# EAGLE schematic FLR - Schematic (EAGLE 9.6.2)
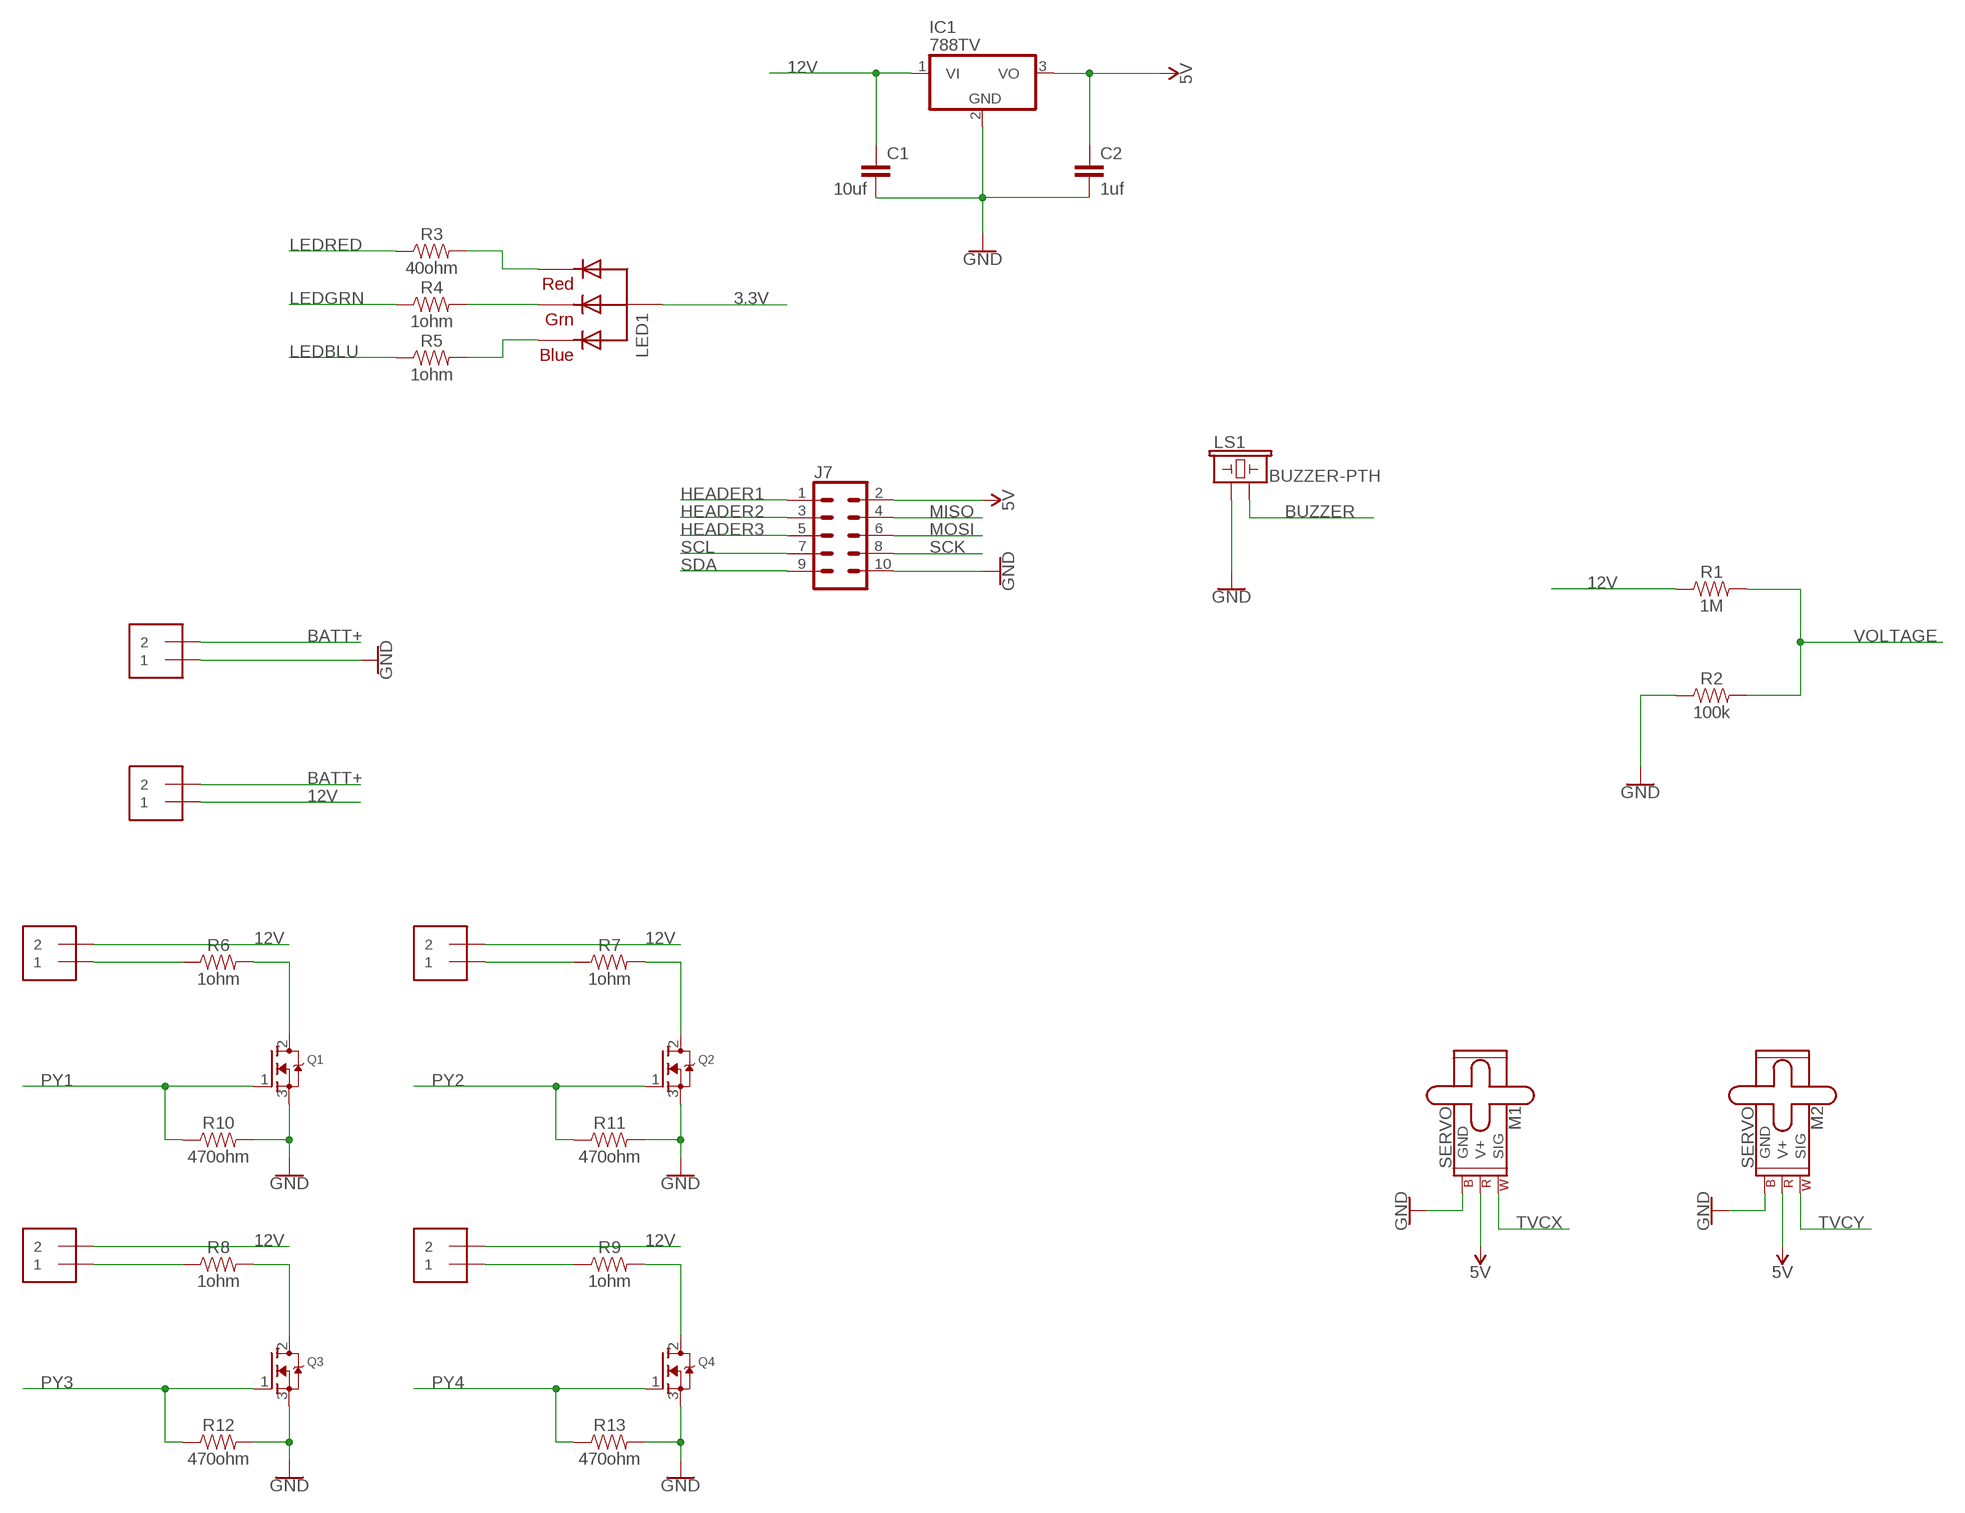
[diagram p0: schematic, sheet 1, part 1 of 2]
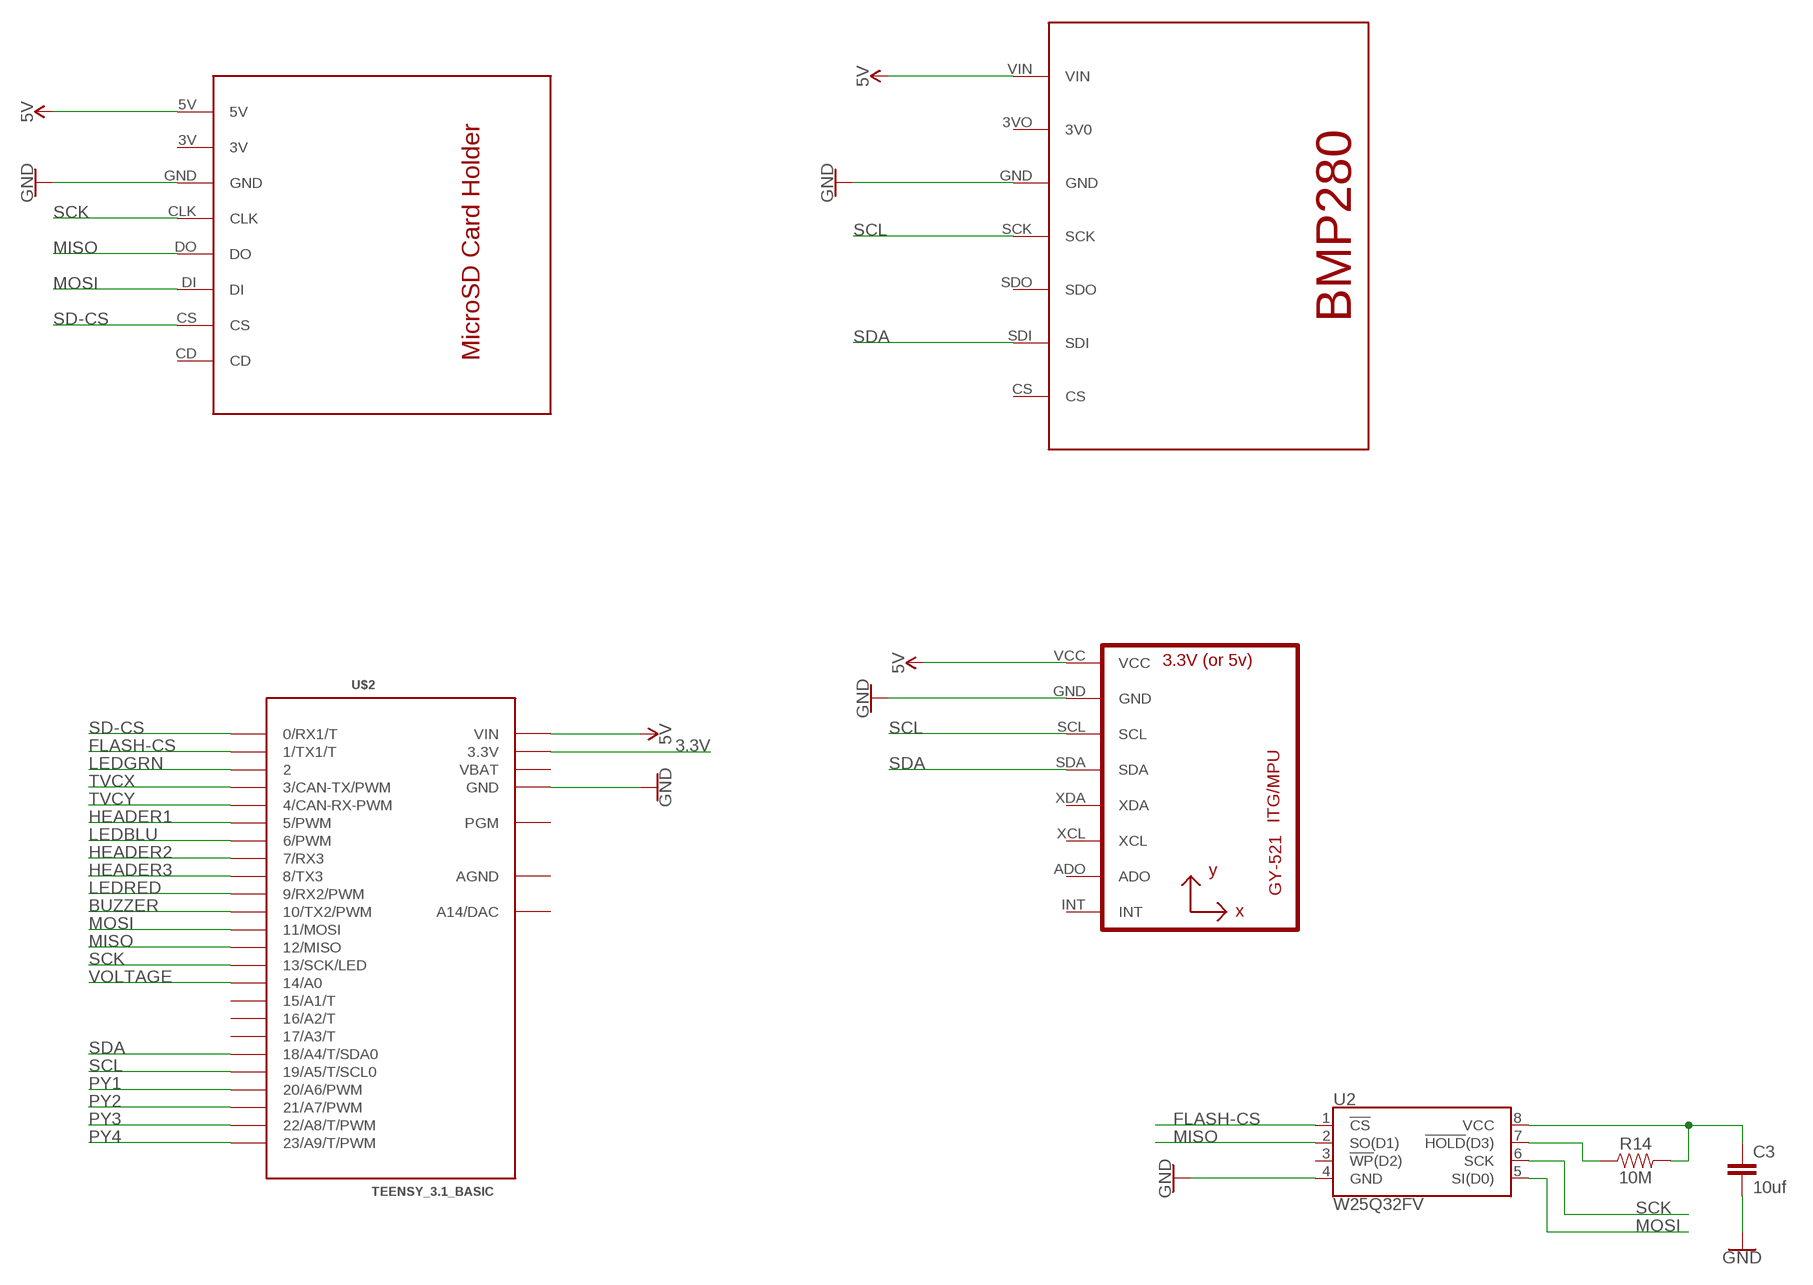
[diagram p1: schematic, sheet 1, part 2 of 2]

## Parts
C1  10uf  22PF-PTH-2.54MM-200V-5%  [CAP-PTH-2.54]
C2  1uf  22PF-PTH-2.54MM-200V-5%  [CAP-PTH-2.54]
C3  10uf  22PF-PTH-2.54MM-200V-5%  [CAP-PTH-2.54]
IC1  788TV  [TO220V]
J1  1X2-3.5MM  [1X2-3.5MM]
J2  1X2-3.5MM  [1X2-3.5MM]
J3  1X2-3.5MM  [1X2-3.5MM]
J4  1X2-3.5MM  [1X2-3.5MM]
J5  1X2-3.5MM  [1X2-3.5MM]
J6  1X2-3.5MM  [1X2-3.5MM]
J7  CONN_05X2NO_SILK  [2X5_NOSILK]
LED1  RGBLED_CA-5MM  [LED5MMRGB]
LS1  BUZZER-PTH  [BUZZER-12MM]
M1  SERVO  [1X03]
M2  SERVO  [1X03]
Q1  MOSFET-NGDS_TO220V  [TO220V]
Q2  MOSFET-NGDS_TO220V  [TO220V]
Q3  MOSFET-NGDS_TO220V  [TO220V]
Q4  MOSFET-NGDS_TO220V  [TO220V]
R1  1M  10MOHM-HORIZ-1/4W-5%  [AXIAL-0.3]
R2  100k  10MOHM-HORIZ-1/4W-5%  [AXIAL-0.3]
R3  40ohm  10MOHM-HORIZ-1/4W-5%  [AXIAL-0.3]
R4  1ohm  10MOHM-HORIZ-1/4W-5%  [AXIAL-0.3]
R5  1ohm  10MOHM-HORIZ-1/4W-5%  [AXIAL-0.3]
R6  1ohm  10MOHM-HORIZ-1/4W-5%  [AXIAL-0.3]
R7  1ohm  10MOHM-HORIZ-1/4W-5%  [AXIAL-0.3]
R8  1ohm  10MOHM-HORIZ-1/4W-5%  [AXIAL-0.3]
R9  1ohm  10MOHM-HORIZ-1/4W-5%  [AXIAL-0.3]
R10  470ohm  10MOHM-HORIZ-1/4W-5%  [AXIAL-0.3]
R11  470ohm  10MOHM-HORIZ-1/4W-5%  [AXIAL-0.3]
R12  470ohm  10MOHM-HORIZ-1/4W-5%  [AXIAL-0.3]
R13  470ohm  10MOHM-HORIZ-1/4W-5%  [AXIAL-0.3]
R14  10M  10MOHM-HORIZ-1/4W-5%  [AXIAL-0.3]
U1  GY-521MPU6050  [GY-521]
U2  W25Q32FV  W25Q32FVSS  [SOIC-8]
U$1  MICROSDCARD  [MICROSDCARD]
U$2  TEENSY_3.1_BASIC  [TEENSY_3.1_BASIC]
U$3  BMP280  [BMP280]

## Nets
3.3V: LED1.2(VCC) U$2.3.3V U$2.3.3V1(3.3V)
5V: C2.1 IC1.3(VO) J7.2 M1.2(V+) M2.2(V+) U1.VCC U$1.5V U$2.VIN U$3.VIN
12V: C1.1 IC1.1(VI) J2.1 J3.2 J4.2 J5.2 J6.2 R1.P$1
BATT+: J1.2 J2.2
BUZZER: LS1.- U$2.10(10/TX2/PWM)
FLASH-CS: U2.1(!CS!) U$2.1(1/TX1/T)
GND: C1.2 C2.2 C3.2 IC1.2(GND) J1.1 J7.10 LS1.+ M1.3(GND) M2.3(GND) Q1.3(S) Q2.3(S) Q3.3(S) Q4.3(S) R2.P$1 R10.P$2 R11.P$2 R12.P$2 R13.P$2 U1.GND U2.4(GND) U$1.GND U$2.GND U$2.GND1(GND) U$3.GND
HEADER1: J7.1 U$2.5(5/PWM)
HEADER2: J7.3 U$2.7(7/RX3)
HEADER3: J7.5 U$2.8(8/TX3)
LEDBLU: R5.P$1 U$2.6(6/PWM)
LEDGRN: R4.P$1 U$2.2
LEDRED: R3.P$1 U$2.9(9/RX2/PWM)
MISO: J7.4 U2.2(SO(D1)) U$1.DO U$2.12(12/MISO)
MOSI: J7.6 U2.5(SI(D0)) U$1.DI U$2.11(11/MOSI)
N$1: Q1.2(D) R6.P$2
N$2: LED1.1(RED) R3.P$2
N$3: LED1.3(GREEN) R4.P$2
N$4: LED1.4(BLUE) R5.P$2
N$5: J3.1 R6.P$1
N$6: Q2.2(D) R7.P$2
N$7: J4.1 R7.P$1
N$8: Q3.2(D) R8.P$2
N$9: J5.1 R8.P$1
N$10: Q4.2(D) R9.P$2
N$11: J6.1 R9.P$1
N$12: C3.1 R14.P$2 U2.8(VCC)
N$13: R14.P$1 U2.7(!HOLD!(D3))
PY1: Q1.1(G) R10.P$1 U$2.20/A6(20/A6/PWM)
PY2: Q2.1(G) R11.P$1 U$2.21/A7(21/A7/PWM)
PY3: Q3.1(G) R12.P$1 U$2.22/A8(22/A8/T/PWM)
PY4: Q4.1(G) R13.P$1 U$2.23/A9(23/A9/T/PWM)
SCK: J7.8 U2.6(SCK) U$1.CLK U$2.13(13/SCK/LED)
SCL: J7.7 U1.SCL U$2.19/A5(19/A5/T/SCL0) U$3.SCK
SD-CS: U$1.CS U$2.0(0/RX1/T)
SDA: J7.9 U1.SDA U$2.18/A4(18/A4/T/SDA0) U$3.SDI
TVCX: M1.1(SIG) U$2.3(3/CAN-TX/PWM)
TVCY: M2.1(SIG) U$2.4(4/CAN-RX-PWM)
VOLTAGE: R1.P$2 R2.P$2 U$2.14/A0
Unconnected: U1.ADO U1.INT U1.XCL U1.XDA U2.3(!WP!(D2)) U$1.3V U$1.CD U$2.15/A1(15/A1/T) U$2.16/A2(16/A2/T) U$2.17/A3(17/A3/T) U$2.A14(A14/DAC) U$2.PGM U$3.3VO(3V0) U$3.CS U$3.SDO

## Power pins joined to a net without a drawn wire
AGND: U$2.AGND
VBAT: U$2.VBAT

## Library data of the parts
C1-C3 = SparkFun-Capacitors:22PF: 22pF ceramic capacitors A capacitor is a passive two-terminal electrical component used to store electrical energy temporarily in an electric field.; PROD_ID: CAP-09128; VALUE: 22pF
IC1 = linear:78*: Positive VOLTAGE REGULATOR Source: http://cache.national.com/ds/LM/LM78L05.pdf http://www.fairchildsemi.com/ds/LM/LM7805.pdf
J1-J6 = adafruit:1X2: 3.5mm Terminal block http://www.ladyada.net/library/pcb/eaglelibrary.html
J7 = SparkFun-Connectors:CONN_05X2: Multi connection point. Often used as Generic Header-pin footprint for 0.1 inch spaced/style header connections For AVR SPI programming port, see special device with nice symbol: "AVR_SPI_PROG_5x2.dev" You can populate with any combo of single row headers, but if you'd like an exact match, check these: 2x5 AVR ICSP Male Header <https://www.sparkfun.com/products/778> (PRT-00778) 2x5 Pin Shrouded Header <https://www.sparkfun.com/products/8506> (PRT-08506) On any of the 0.1 inch spaced packages, you can populate with these: Break Away Headers - Straight <https://www.sparkfun.com/products/116> (PRT-00116) Break Away Male Headers - Right Angle <https://www.sparkfun.com/products/553> (PRT-00553) Female Headers <https://www.sparkfun.com/products/115> (PRT-00115) Break Away Headers - Machine Pin <https://www.sparkfun.com/products/117> (PRT-00117) Break Away Female Headers - Swiss Machine Pin <https://www.sparkfun.com/products/743> (PRT-00743) Special note: the shrouded connector mates well with our 5x2 ribbon cables: 2x5 Pin IDC Ribbon Cable <https://www.sparkfun.com/products/8535> (PRT-08535)
LED1 = adafruit:RGBLED_CA: RGB LED, common-anode 5MM Staggered pins 5mm Piranha package http://www.ladyada.net/library/pcb/eaglelibrary.html
LS1 = SparkFun-Electromechanical:BUZZER: Buzzer Small round buzzers that operate around the audible 2kHz range. You can use these as speakers to create simple music or user interfaces. Variant Overview: PTH - Mini Speaker - PC Mount 12mm 2.048kHz <https://www.sparkfun.com/products/7950> PTH_KIT - Mini Speaker - PC Mount 12mm 2.048kHz <https://www.sparkfun.com/products/7950> KIT simplifies soldering by adding stop mask to one side of the pads. PTH_NO_SILK - Mini Speaker - PC Mount 12mm 2.048kHz <https://www.sparkfun.com/products/7950> No silkscreen indicator of buzzer outline. PTH_KIT_NO_SILK - Mini Speaker - PC Mount 12mm 2.048kHz <https://www.sparkfun.com/products/7950> KIT package w/o silkscreen SMD - Buzzer Audio Magnetic (CCV-084B16) SMD buzzer used on, e.g. the LilyPad Buzzer <https://www.sparkfun.com/products/8463> and RFID USB Reader <https://www.sparkfun.com/products/9963>. SMD_KIT - Buzzer Audio Magnetic (CCV-084B16) SMD Buzzer with elongated pins to make soldering easier. Used on the SparkFun Simon Says - Surface Mount Soldering Kit <https://www.sparkfun.com/products/10935>.; PROD_ID: COMP-08253; SF_SKU: COM-07950
M1 M2 = SparkFun-Electromechanical:SERVO: Servo Motor 3-pin connector for a standard servo motor (voltage supply, ground, and control signal.) SparkFun Products Servo - Generic (Sub-Micro Size) <https://www.sparkfun.com/products/9065> (ROB-09065) Servo - Generic High Torque Continuous Rotation (Standard Size) <https://www.sparkfun.com/products/9347> (ROB-09347) Servo - Generic High Torque (Standard Size) <https://www.sparkfun.com/products/11965> (ROB-11965)
Q1-Q4 = adafruit:MOSFET-N: N-Channel Mosfet 2N7002E - 60V 260mA SOT23 [Digikey: 2N7002ET1GOSTR-ND] - REEL BSH103 - 30V 850mA SOT23 [Digikey: 568-5013-1-ND]
R1-R13 = SparkFun-Resistors:10MOHM: RES-09327; PROD_ID: RES-09327; VALUE: 10M
R14 = SparkFun-Resistors:10MOHM: RES-09327; PROD_ID: RES-09327
U1 = gy-521:GY-521
U2 = SparkFun-IC-Memory:W25Q32FV: W25Q32FV 32Mb (4MB) Serial Flash Memory The W25Q32FV support the standard Serial Peripheral Interface (SPI), Dual/Quad I/O SPI as well as 2-clocks instruction cycle Quad Peripheral Interface (QPI). 104MHz, SPI, 8-SOIC-EIAJ Datasheet <http://www.winbond.com/resource-files/w25q32fv%20revh%20091613.pdf> SparkFun Products SparkFun Blynk Board - ESP8266 <https://www.sparkfun.com/products/13794> (WRL-13794); PROD_ID: IC-13229
U$1 = MicroSD Card Holder:MICROSDCARD
U$2 = Teensy_3_Series_Board_v1.0:TEENSY_3.1_BASIC: Footprint for Teensy 3.1 board using all pin connections on the outer perimeter
U$3 = BMP280:BMP280